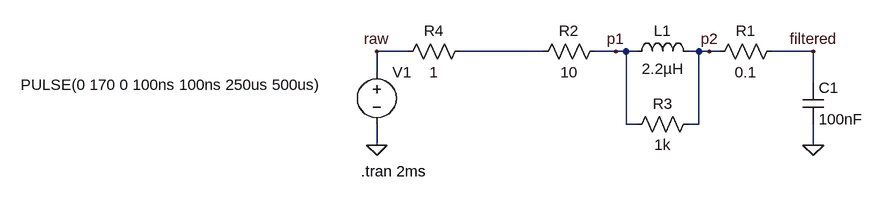
[diagram p0: schematic square wave rounder.asc]
square wave rounder.asc, the LTspice schematic file:
Version 4
SHEET 1 880 680
WIRE -64 80 -112 80
WIRE 144 80 16 80
WIRE 256 80 224 80
WIRE 272 80 256 80
WIRE 288 80 272 80
WIRE 384 80 368 80
WIRE 400 80 384 80
WIRE 416 80 400 80
WIRE 560 80 496 80
WIRE -112 112 -112 80
WIRE 560 128 560 80
WIRE 272 192 272 80
WIRE 288 192 272 192
WIRE 384 192 384 80
WIRE 384 192 368 192
WIRE -112 224 -112 192
WIRE 560 224 560 192
FLAG -112 224 0
FLAG 560 224 0
FLAG -112 80 raw
FLAG 256 80 p1
FLAG 400 80 p2
FLAG 560 80 filtered
SYMBOL voltage -112 96 R0
WINDOW 3 -548 35 Left 2
WINDOW 123 0 0 Left 0
WINDOW 39 0 0 Left 0
SYMATTR Value PULSE(0 170 0 100ns 100ns 250us 500us)
SYMATTR InstName V1
SYMBOL cap 544 128 R0
SYMATTR InstName C1
SYMATTR Value 100nF
SYMBOL res 128 96 R270
WINDOW 0 32 56 VTop 2
WINDOW 3 0 56 VBottom 2
SYMATTR InstName R2
SYMATTR Value 10
SYMBOL ind 272 96 R270
WINDOW 0 32 56 VTop 2
WINDOW 3 5 56 VBottom 2
SYMATTR InstName L1
SYMATTR Value 2.2µH
SYMBOL res 400 96 R270
WINDOW 0 32 56 VTop 2
WINDOW 3 0 56 VBottom 2
SYMATTR InstName R1
SYMATTR Value 0.1
SYMBOL res 272 208 R270
WINDOW 0 32 56 VTop 2
WINDOW 3 0 56 VBottom 2
SYMATTR InstName R3
SYMATTR Value 1k
SYMBOL res 32 64 R90
WINDOW 0 0 56 VBottom 2
WINDOW 3 32 56 VTop 2
SYMATTR InstName R4
SYMATTR Value 1
TEXT -136 264 Left 2 !.tran 2ms

The netlist it stands for:
* square wave rounder.asc
V1 raw 0 PULSE(0 170 0 100ns 100ns 250us 500us)
C1 filtered 0 100nF
R2 N001 p1 10
L1 p1 p2 2.2µH
R1 p2 filtered 0.1
R3 p1 p2 1k
R4 N001 raw 1
.tran 2ms
.backanno
.end